# Altium project CHUVEIRO ECOLOGICO.PrjPcb
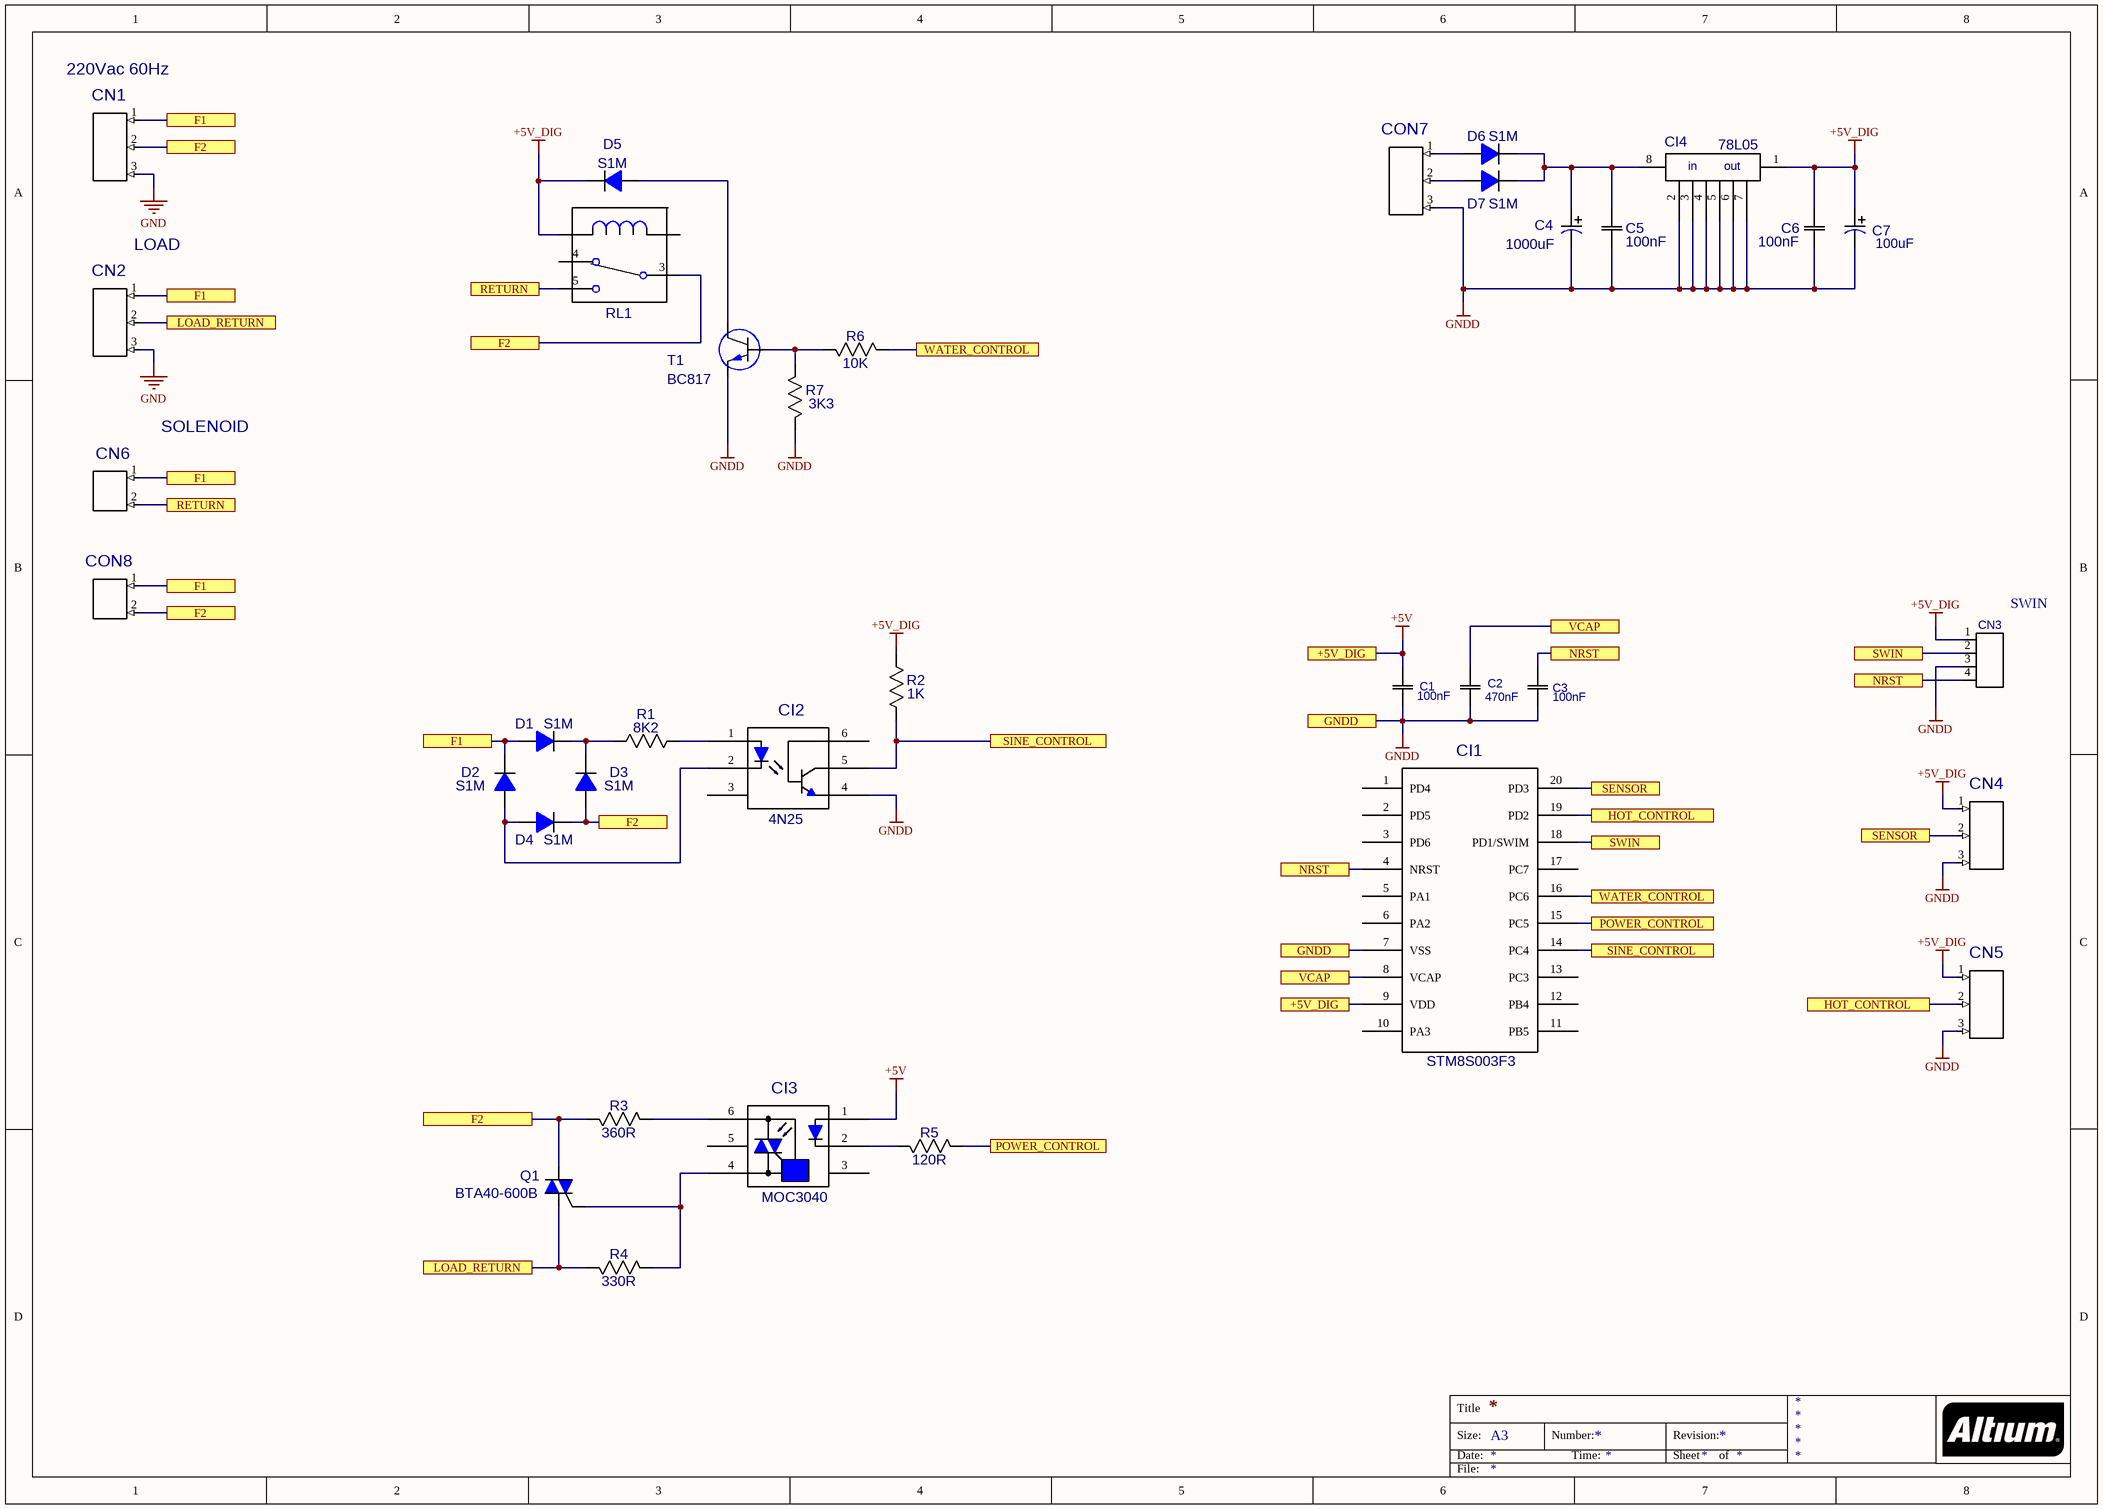
[diagram p0: CHUVEIRO ECOLOGICO.SchDoc]
1 sheet, 36 parts. Net scope: flat (ports and power ports of the same name join across sheets).
Board file: CHUVEIRO ECOLOGICO.PcbDoc

## Sheet CHUVEIRO ECOLOGICO.SchDoc
size A3

### Parts
C1  value 100nF  [C0603]  (hidden comment: C0603)
C2  value 470nF  [C0603]  (hidden comment: C0603)
C3  value 100nF  [C0603]  (hidden comment: C0603)
C4  value 1000uF  [C_ELET_D10P5H20]  (hidden comment: C_ELET_D10P5H20)
C5  value 100nF  [C0603]  (hidden comment: C0603)
C6  value 100nF  [C0603]  (hidden comment: C0603)
C7  value 100uF  [C_ELET_D6.3P2.5]  (hidden comment: C_ELET_D6.3P2.5)
CI1  value STM8S003F3  [TSSOP20]  (hidden comment: CI_STM8S003F3_TSSOP20)
CI2  value 4N25  [CN_1X3_90_PITCH 2,0]  (hidden comment: CI_4N25_DIL6)
CI3  value MOC3040  [Model Name]  (hidden comment: CI_MOC3040_DIL6)
CI4  value 78L05  [SO8]  (hidden comment: CI_78L05_SO8)
CN1  CON_KRE_1X3  [KRE_1X3]  (value not drawn)
CN2  CON_KRE_1X3  [KRE_1X3]  (value not drawn)
CN3  CON_BP1X4_180  [CON_BP1X4_180]  (value not drawn)
CN4  CON_KRE_1X3  [KRE_1X3]  (value not drawn)
CN5  CON_KRE_1X3  [KRE_1X3]  (value not drawn)
CN6  CON_KRE_1X2  [KRE_1X2]  (value not drawn)
CON7  CON_KRE_1X3  [KRE_1X3]  (value not drawn)
CON8  CON_KRE_1X2  [KRE_1X2]  (value not drawn)
D1  value S1M  [S1M]  (hidden comment: D_S1M_DO214AC)
D2  value S1M  [S1M]  (hidden comment: D_S1M_DO214AC)
D3  value S1M  [S1M]  (hidden comment: D_S1M_DO214AC)
D4  value S1M  [S1M]  (hidden comment: D_S1M_DO214AC)
D5  value S1M  [S1M]  (hidden comment: D_S1M_DO214AC)
D6  value S1M  [S1M]  (hidden comment: D_S1M_DO214AC)
D7  value S1M  [S1M]  (hidden comment: D_S1M_DO214AC)
Q1  value BTA40-600B  (hidden comment: BT151)
R1  value 8K2  [R0603]  (hidden comment: R0603)
R2  value 1K  [R0603]  (hidden comment: R0603)
R3  value 360R  [R0603]  (hidden comment: R0603)
R4  value 330R  [R0603]  (hidden comment: R0603)
R5  value 120R  [R0603]  (hidden comment: R0603)
R6  value 10K  [R0603]  (hidden comment: R0603)
R7  value 3K3  [R0603]  (hidden comment: R0603)
RL1  REL_NF_20A  [REL_NF]  (value not drawn)
T1  value BC817  [SOT23_BC817]  (hidden comment: T_BC817_SOT23)

### Ports
+5V_DIG, F1, F2, GNDD, HOT_CONTROL, LOAD_RETURN, NRST, POWER_CONTROL, RETURN, SENSOR, SINE_CONTROL, SWIN, VCAP, WATER_CONTROL

### Nets
+5V: C1.2 CI1.9(VDD) CI3.1(A) ; port +5V_DIG
+5V_DIG: C6.2 C7.2(PLUS) CI4.1(OUT) CN3.1 CN4.1 CN5.1 D5.2(A) R2.1(A) RL1.2(L2)
GND: CN1.3 CN2.3
GNDD: C1.1 C2.1 C3.1 C4.1(PLUS) C5.1 C6.1 C7.1(MINUS) CI1.7(VSS) CI2.4(E) CI4.2(GND) CI4.3(GND) CI4.4(GND) CI4.5(GND) CI4.6(GND) CI4.7(NC) CN3.3 CN4.3 CN5.3 CON7.3 R7.2(B) T1.2(E) ; port GNDD
NetC2_2: C2.2 CI1.8(VCAP) ; port VCAP
NetC3_2: C3.2 CI1.4(NRST) CN3.4 ; port NRST
NetC4_2: C4.2(MINUS) C5.2 CI4.8(IN) D6.2(A) D7.2(A)
NetCI1_14: CI1.14(PC4) CI2.5(C) R2.2(B) ; port SINE_CONTROL
NetCI1_15: CI1.15(PC5) R5.2(B) ; port POWER_CONTROL
NetCI1_16: CI1.16(PC6) R6.2(B) ; port WATER_CONTROL
NetCI1_18: CI1.18(PD1/SWIM) CN3.2 ; port SWIN
NetCI1_19: CI1.19(PD2) CN5.2 ; port HOT_CONTROL
NetCI1_20: CI1.20(PD3) CN4.2 ; port SENSOR
NetCI2_1: CI2.1(A) R1.1(A)
NetCI2_2: CI2.2(K) D2.1(K) D4.1(K)
NetCI3_2: CI3.2(K) R5.1(A)
NetCI3_4: CI3.4(E) Q1.1(G) R4.2(B)
NetCI3_6: CI3.6(B) R3.2(B)
NetCN1_1: CN1.1 CN2.1 CN6.1 CON8.1 D1.1(K) D2.2(A) ; port F1
NetCN1_2: CN1.2 CON8.2 D3.1(K) D4.2(A) Q1.3(M1) R3.1(A) RL1.3(C) ; port F2
NetCN2_2: CN2.2 Q1.2(M2) R4.1(A) ; port LOAD_RETURN
NetCN6_2: CN6.2 RL1.5(NA) ; port RETURN
NetCON7_1: CON7.1 D6.1(K)
NetCON7_2: CON7.2 D7.1(K)
NetD1_2: D1.2(A) D3.2(A) R1.2(B)
NetD5_1: D5.1(K) T1.3(C)
NetR6_1: R6.1(A) R7.1(A) T1.1(B)

Not connected (* = marked no-connect by the designer): CI1 1(PD4) 2(PD5) 3(PD6) 5(PA1) 6(PA2) 10(PA3) 11(PB5) 12(PB4) 13(PC3) 17(PC7); CI2 3(NC) 6(B); CI3 3(NC) 5(C); RL1 1(L1) 4(NF)

### Notes on the sheet
- (near CN1) 220Vac 60Hz
- LOAD
- (near CN6) SOLENOID
- (near CN3) SWIN
- Title
- Size:
- Date:
- A3
- Number:
- Time:
- Revision:
- Sheet
- of
- File:
- (in symbol CI_78L05_SO8) in; out

### Library data of the parts
C1 C3 = C0603: Capacitor; Part Number: 002.01.00003
C2 = C0603: Capacitor; Part Number: 002.01.00019
C4 = C_ELET_D10P5H20: Radial Polarized Capacitor
C5 C6 = CAP 0603 100nF 50V X7R 10%: Capacitor; Part Number: 002.01.00003
C7 = C_ELET_D6.3P2.5: Radial Polarized Capacitor; Part Number: 002.07.00015; TENSAO: 35V
CI2 = CI_4N25_DIL6: 4N25
CI4 = CI_78L05_SO8: Glass Zener Diode, 500 Milliwatt
CN1 CN2 CN4 CN5 CON7 = CON_KRE_1X3: Boardmount Pin Connector; Value: *
CN3 = CON_BP1X4_180: Capacitor; Value: SWIM
CN6 CON8 = CON_KRE_1X2: Boardmount Pin Connector; Value: *
D1-D7 = D_S1M_DO214AC (SMA): RETIFICADOR; Part Number: 005.01.00004
Q1 = Q_BTA24-600B: TRIAC
R1-R7 = R0603: Resistor
RL1 = REL_NF_20A: RELE SIMPLES REVERSOR 20A; Part Number: 008.00.00002; Value: REL_NF_20A
T1 = T_BC817_SOT23: Glass Zener Diode, 500 Milliwatt